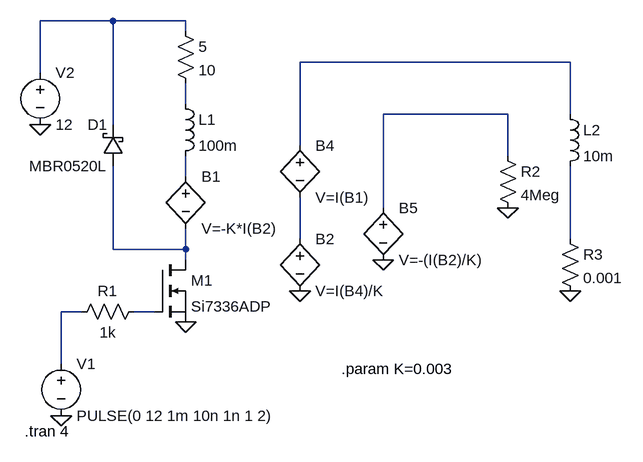
[diagram p0: schematic Draft1.asc]
Draft1.asc, the LTspice schematic file:
Version 4
SHEET 1 1496 872
WIRE 0 -304 -112 -304
WIRE 112 -304 0 -304
WIRE 112 -288 112 -304
WIRE 704 -240 288 -240
WIRE -112 -224 -112 -304
WIRE 112 -176 112 -208
WIRE 608 -160 416 -160
WIRE 704 -160 704 -240
WIRE 0 -144 0 -304
WIRE 288 -112 288 -240
WIRE 608 -96 608 -160
WIRE 112 -64 112 -96
WIRE 416 -16 416 -160
WIRE 288 32 288 -32
WIRE 704 32 704 -80
WIRE 0 48 0 -80
WIRE 112 48 112 16
WIRE 112 48 0 48
WIRE 112 64 112 48
WIRE -48 144 -80 144
WIRE 64 144 32 144
WIRE -80 224 -80 144
FLAG -80 304 0
FLAG -112 -144 0
FLAG 112 160 0
FLAG 704 112 0
FLAG 288 112 0
FLAG 416 64 0
FLAG 608 -16 0
SYMBOL nmos 64 64 R0
SYMATTR InstName M1
SYMATTR Value Si7336ADP
SYMBOL voltage -80 208 R0
WINDOW 123 0 0 Left 0
WINDOW 39 0 0 Left 0
SYMATTR InstName V1
SYMATTR Value PULSE(0 12 1m 10n 1n 1 2)
SYMBOL res 48 128 R90
WINDOW 0 0 56 VBottom 2
WINDOW 3 32 56 VTop 2
SYMATTR InstName R1
SYMATTR Value 1k
SYMBOL ind 96 -192 R0
SYMATTR InstName L1
SYMATTR Value 100m
SYMBOL res 96 -304 R0
SYMATTR InstName 5
SYMATTR Value 10
SYMBOL voltage -112 -240 R0
WINDOW 123 0 0 Left 0
WINDOW 39 0 0 Left 0
SYMATTR InstName V2
SYMATTR Value 12
SYMBOL bv 112 -80 R0
SYMATTR InstName B1
SYMATTR Value V=-K*I(B2)
SYMBOL schottky 16 -80 R180
WINDOW 0 24 64 Left 2
WINDOW 3 24 0 Left 2
SYMATTR InstName D1
SYMATTR Value MBR0520L
SYMATTR Description Diode
SYMATTR Type diode
SYMBOL bv 288 16 R0
SYMATTR InstName B2
SYMATTR Value V=I(B4)/K
SYMBOL res 688 16 R0
SYMATTR InstName R3
SYMATTR Value 0.001
SYMBOL ind 688 -176 R0
SYMATTR InstName L2
SYMATTR Value 10m
SYMBOL bv 288 -128 R0
SYMATTR InstName B4
SYMATTR Value V=I(B1)
SYMBOL bv 416 -32 R0
SYMATTR InstName B5
SYMATTR Value V=-(I(B2)/K)
SYMBOL res 592 -112 R0
SYMATTR InstName R2
SYMATTR Value 4Meg
TEXT -136 328 Left 2 !.tran 4
TEXT 352 232 Left 2 !.param K=0.003

The netlist it stands for:
* Draft1.asc
M1 N008 N010 0 0 Si7336ADP
V1 N009 0 PULSE(0 12 1m 10n 1n 1 2)
R1 N010 N009 1k
L1 N003 N005 100m
R§5 N001 N003 10
V2 N001 0 12
B1 N005 N008 V=-K*I(B2)
D1 N008 N001 MBR0520L
B2 N006 0 V=I(B4)/K
R3 N007 0 0.001
L2 N002 N007 10m
B4 N002 N006 V=I(B1)
B5 N004 0 V=-(I(B2)/K)
R2 N004 0 4Meg
.model D D
.lib standard.dio
.model NMOS NMOS
.model PMOS PMOS
.lib standard.mos
.tran 4
.param K=0.003
.backanno
.end